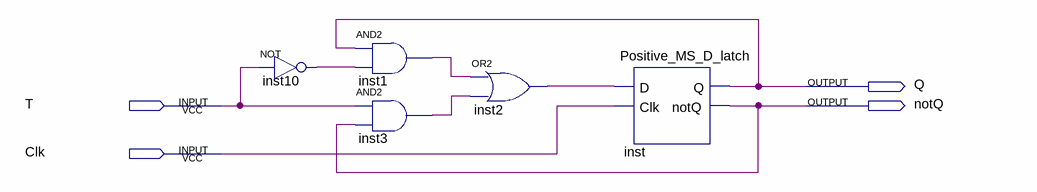
[diagram p0: schematic sheet]
// Quartus schematic T_ff.bdf as structural Verilog: 5 symbols, 4 pins
module T_ff (
  input  T,
  input  Clk,
  output Q,
  output notQ
);

  wire inst1_out, inst2_out, inst3_out, inst10_out;

  not inst10 (inst10_out, T);
  and inst1 (inst1_out, Q, inst10_out);
  and inst3 (inst3_out, T, notQ);
  or inst2 (inst2_out, inst1_out, inst3_out);
  Positive_MS_D_latch inst (.D(inst2_out), .Clk(Clk), .Q(Q), .notQ(notQ));
endmodule
